# Altium schematic sheet Battery_Boost_Converter.SchDoc
size A4
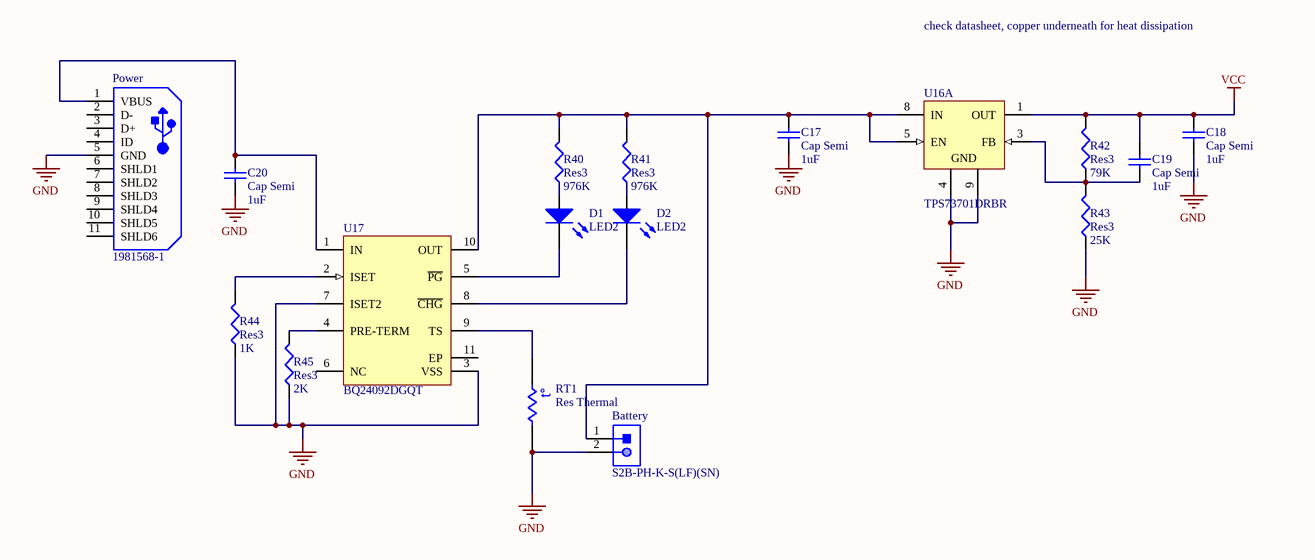
[diagram p0: Battery_Boost_Converter.SchDoc]

## Parts
Battery  S2B-PH-K-S(LF)(SN)  [JST-S2B-PH-K-S_V]
C17  Cap Semi  value 1uF  [C1206]
C18  Cap Semi  value 1uF  [C1206]
C19  Cap Semi  value 1uF  [C1206]
C20  Cap Semi  value 1uF  [C1206]
D1  LED2  [3.2X1.6X1.1]
D2  LED2  [3.2X1.6X1.1]
Power  1981568-1  [TECO-1981568-5_V]
R40  Res3  value 976K  [J1-0603]
R41  Res3  value 976K  [J1-0603]
R42  Res3  value 79K  [J1-0603]
R43  Res3  value 25K  [J1-0603]
R44  Res3  value 1K  [J1-0603]
R45  Res3  value 2K  [J1-0603]
RT1  Res Thermal  [6-0805_N]
U16  TPS73701DRBR  [DRB0008A_V]  (part A of 2)
U17  BQ24092DGQT  [DGQ0010D_L]

## Nets
GND: Battery.2 C17.1 C18.1 C20.1 Power.5(GND) R43.1 R44.1 R45.1 RT1.2 U16.4(GND) U16.9(GND) U17.3(VSS) U17.7(ISET2)
VCC: C18.2 C19.2 R42.2 U16.1(OUT)
NetBattery_1: Battery.1 C17.2 R40.2 R41.2 U16.5(EN) U16.8(IN) U17.10(OUT)
NetC19_1: C19.1 R42.1 R43.2 U16.3(FB)
NetC20_2: C20.2 Power.1(VBUS) U17.1(IN)
NetD1_1: D1.1(A) R40.1
NetD1_2: D1.2(K) U17.5(~{PG})
NetD2_1: D2.1(A) R41.1
NetD2_2: D2.2(K) U17.8(~{CHG})
NetR44_2: R44.2 U17.2(ISET)
NetR45_2: R45.2 U17.4(PRE-TERM)
NetRT1_1: RT1.1 U17.9(TS)

Not connected (* = marked no-connect by the designer): Power 2(D-) 3(D+) 4(ID) 6(SHLD1) 7(SHLD2) 8(SHLD3) 9(SHLD4) 10(SHLD5) 11(SHLD6); U17 6(NC) 11(EP)

## Notes on the sheet
- check datasheet, copper underneath for heat dissipation
- (in symbol Res Thermal) t°

## Library data of the parts
Battery = CMP-1755-00004-1: Male Header, Pitch 2 mm, 1 x 2 Position, Height 4.8 mm, Tail Length 3.4 mm, -25 to 85 degC, RoHS, Bulk; Case\Package: Radial; Tolerance: 20%; Capacitance: 10 uF; Voltage Rating (DC): 50 V; Packaging: Bulk; ComponentLink1URL: http://www.jst-mfg.com/product/pdf/eng/ePH.pdf; Radiation Hardening: No; Height: 11 mm; Package Quantity: 200; PackageDescription: Male Header, Pitch 2 mm, 1 x 2 Position, Height 4.8 mm, Tail Length 3.4 mm; PackageReference: S2B-PH-K-S; Diameter: 5 mm; Pins: 2; Mount: Through Hole; Max Operating Temperature: 85 degC; Min Operating Temperature: -40 degC; ComponentLink1Description: Datasheet; DatasheetVersion: Dec-12; Length: 11 mm; Lead Pitch: 2 mm; REACH SVHC: No SVHC; Voltage Rating: 50 V; RoHSCompliant: true
C17-C20 = Cap Semi: Capacitor (Semiconductor SIM Model); Published: 8-Jun-2000; LatestRevisionDate: 29-May-2009; LatestRevisionNote: IPC-7351 Footprint Added.; PackageReference: C1206; Publisher: Altium Limited; PackageDescription: Chip Capacitor
D1 D2 = LED2: Typical RED, GREEN, YELLOW, AMBER GaAs LED; Published: 8-Jun-2000; LatestRevisionDate: 17-Jul-2002; LatestRevisionNote: Re-released for DXP Platform.; PackageReference: 3.2X1.6X1.1; Publisher: Altium Limited; PackageDescription: SM LED; 2 Flat Leads; PackageVersion: Feb-2002
Power = CMP-2000-05408-1: Micro USB Receptacle Standard Type B Assy, 5-Pin SMD, RoHS, Tape and Reel; Manufacturer: TE Connectivity; Body Orientation: RightAngle; Number of Ports: 1Port; Number of Contacts: 5POS; Gender: RCP; Voltage Rating Max: 30VAC; Product Depth (mm): 5.6mm; Pitch (mm): 0.65mm; Current Rating (Max): 1/ContactA; Product Length (mm): 8mm; Product Height (mm): 3mm; Operating Temperature Max Deg. C: 85C; Datasheet URL: http://www.mouser.com/ds/2/418/NG_CD_1981568_E2-621296.pdf; Termination Method: Solder; Number of Terminals: 5; Operating Temp Range: -55Cto85C; Mounting Style: SurfaceMount; Manufacturer URL: http://www.te.com/; Contact Material: CopperAlloy; Packaging: TapeandReel; Datasheet Version: Rev. E2, 08/2015; Operating Temperature Min Deg. C: -55C; Housing Material: Thermoplastic; Type: MicroUSB; Contact Plating: GoldOverNickel
R40-R45 = Res3: Resistor; Published: 8-Jun-2000; LatestRevisionDate: 29-May-2009; LatestRevisionNote: IPC-7351 Footprint Added.; PackageReference: J1-0603; Publisher: Altium Limited; PackageDescription: Chip Resistor
RT1 = Res Thermal: Thermistor; Published: 24-Mar-1999; LatestRevisionDate: 29-May-2009; LatestRevisionNote: IPC-7351 Footprint Added.; PackageVersion: Mar-2003; PackageReference: 6-0805; Publisher: Altium Limited; PackageDescription: Chip Resistor 0805 Case Size; Code_IPC: RESC2012
U16 = CMP-0395-00601-2: Single Output LDO, 1 A, Adjustable 1.2 to 5.5 V Output, 2.2 to 5.5 V Input, with Reverse Current Protection, 8-pin SON (DRB), -40 to 125 degC, Green (RoHS & no Sb/Br); Manufacturer: Texas Instruments; Rating: Catalog; Vdo(Typ)(mV): 130; Iout(Max)(A): 1; Vout Adj(Max)(V): 5.5; Iq(Typ)(mA): 0.3; SubFamily: Single Channel LDO; Vout Adj(Min)(V): 1.2; Accuracy(%): 3; Vin(Min)(V): 2.2; PackageReference: DRB0008A; PackageDescription: 8-Pin Plastic Small Outline, Body 3 x 3 mm, Pitch 0.65 mm; ComponentLink3URL: http://www.ti.com/litv/pdf/mpds118h; Eco-Plan: Green (RoHS & no Sb/Br); ComponentLink1Description: Manufacturer URL; ComponentLink2URL: http://www.ti.com/general/docs/lit/getliterature.tsp?genericPartNumber=TPS73701&fileType=pdf; ComponentLink1URL: http://www.ti.com/; PackageVersion: 4203482-2/K; DatasheetVersion: SBVS067O; ComponentLink2Description: Datasheet; Mounting Technology: Surface Mount; ComponentLink3Description: Package Specification; PartNumber: TPS73701DRBR; Vin(Max)(V): 5.5
U17 = CMP-0321-00905-2: 1 A, Single-Input, Single-Cell Li-Ion Battery Charger with Operation Over JEITA and 10 k ohm NTC, 4.5 V, -40 to 150 degC, 10-pin MSOP-PowerPAD (DGQ), Green (RoHS & no Sb/Br); Manufacturer: Texas Instruments; Over Voltage Protection: N; SubFamily: Battery Charge Management; Vin(Min)(V): 4.5; Eco-Plan: Green (RoHS & no Sb/Br); DatasheetVersion: SLUS968C; ComponentLink1URL: http://www.ti.com/general/docs/lit/getliterature.tsp?genericPartNumber=BQ24092&fileType=pdf; NiMH: N; Lead Acid: N; Li-Ion: N; Mounting Technology: Surface Mount; NiCd: N; PackageVersion: revF, Nov-2011; Code_JEDEC: MO-187-BA-T; ComponentLink1Description: Datasheet; PartNumber: BQ24092DGQT; Li-Polymer: N; PackageDescription: 10-Pin PowerPAD Plastic Small Outline 0.5 mm Pitch, Exposed Pad; PackageReference: DGQ0010D